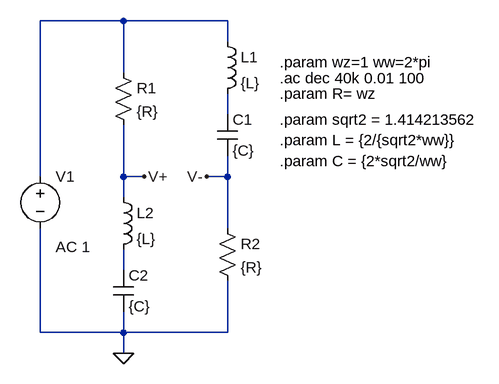
[diagram p0: schematic Ej2_c.asc]
Ej2_c.asc, the LTspice schematic file:
Version 4
SHEET 1 924 680
WIRE 240 -48 112 -48
WIRE 400 -48 240 -48
WIRE 400 -16 400 -48
WIRE 240 32 240 -48
WIRE 400 96 400 64
WIRE 112 192 112 -48
WIRE 240 192 240 112
WIRE 272 192 240 192
WIRE 400 192 400 160
WIRE 400 192 368 192
WIRE 240 224 240 192
WIRE 400 272 400 192
WIRE 240 336 240 304
WIRE 112 432 112 272
WIRE 240 432 240 400
WIRE 240 432 112 432
WIRE 400 432 400 352
WIRE 400 432 240 432
WIRE 240 464 240 432
FLAG 240 464 0
FLAG 272 192 V+
FLAG 368 192 V-
SYMBOL voltage 112 176 R0
WINDOW 123 24 124 Left 2
WINDOW 39 0 0 Left 0
SYMATTR Value2 AC 1
SYMATTR InstName V1
SYMATTR Value ""
SYMBOL res 224 16 R0
SYMATTR InstName R1
SYMATTR Value {R}
SYMBOL ind 384 -32 R0
SYMATTR InstName L1
SYMATTR Value {L}
SYMBOL cap 384 96 R0
SYMATTR InstName C1
SYMATTR Value {C}
SYMBOL ind 224 208 R0
SYMATTR InstName L2
SYMATTR Value {L}
SYMBOL cap 224 336 R0
SYMATTR InstName C2
SYMATTR Value {C}
SYMBOL res 384 256 R0
SYMATTR InstName R2
SYMATTR Value {R}
TEXT 480 104 Left 2 !.param sqrt2 = 1.414213562
TEXT 480 136 Left 2 !.param L = {2/{sqrt2*ww}}
TEXT 480 168 Left 2 !.param C = {2*sqrt2/ww}
TEXT 480 40 Left 2 !.ac dec 40k 0.01 100
TEXT 480 16 Left 2 !.param wz=1 ww=2*pi
TEXT 480 64 Left 2 !.param R= wz

The netlist it stands for:
* Ej2_c.asc
V1 N001 0 AC 1
R1 N001 V+ {R}
L1 N001 N002 {L}
C1 N002 V- {C}
L2 V+ N003 {L}
C2 N003 0 {C}
R2 V- 0 {R}
.param sqrt2 = 1.414213562
.param L = {2/{sqrt2*ww}}
.param C = {2*sqrt2/ww}
.ac dec 40k 0.01 100
.param wz=1 ww=2*pi
.param R= wz
.backanno
.end